# EAGLE schematic CentralBoard less-smd (EAGLE 9.6.2)
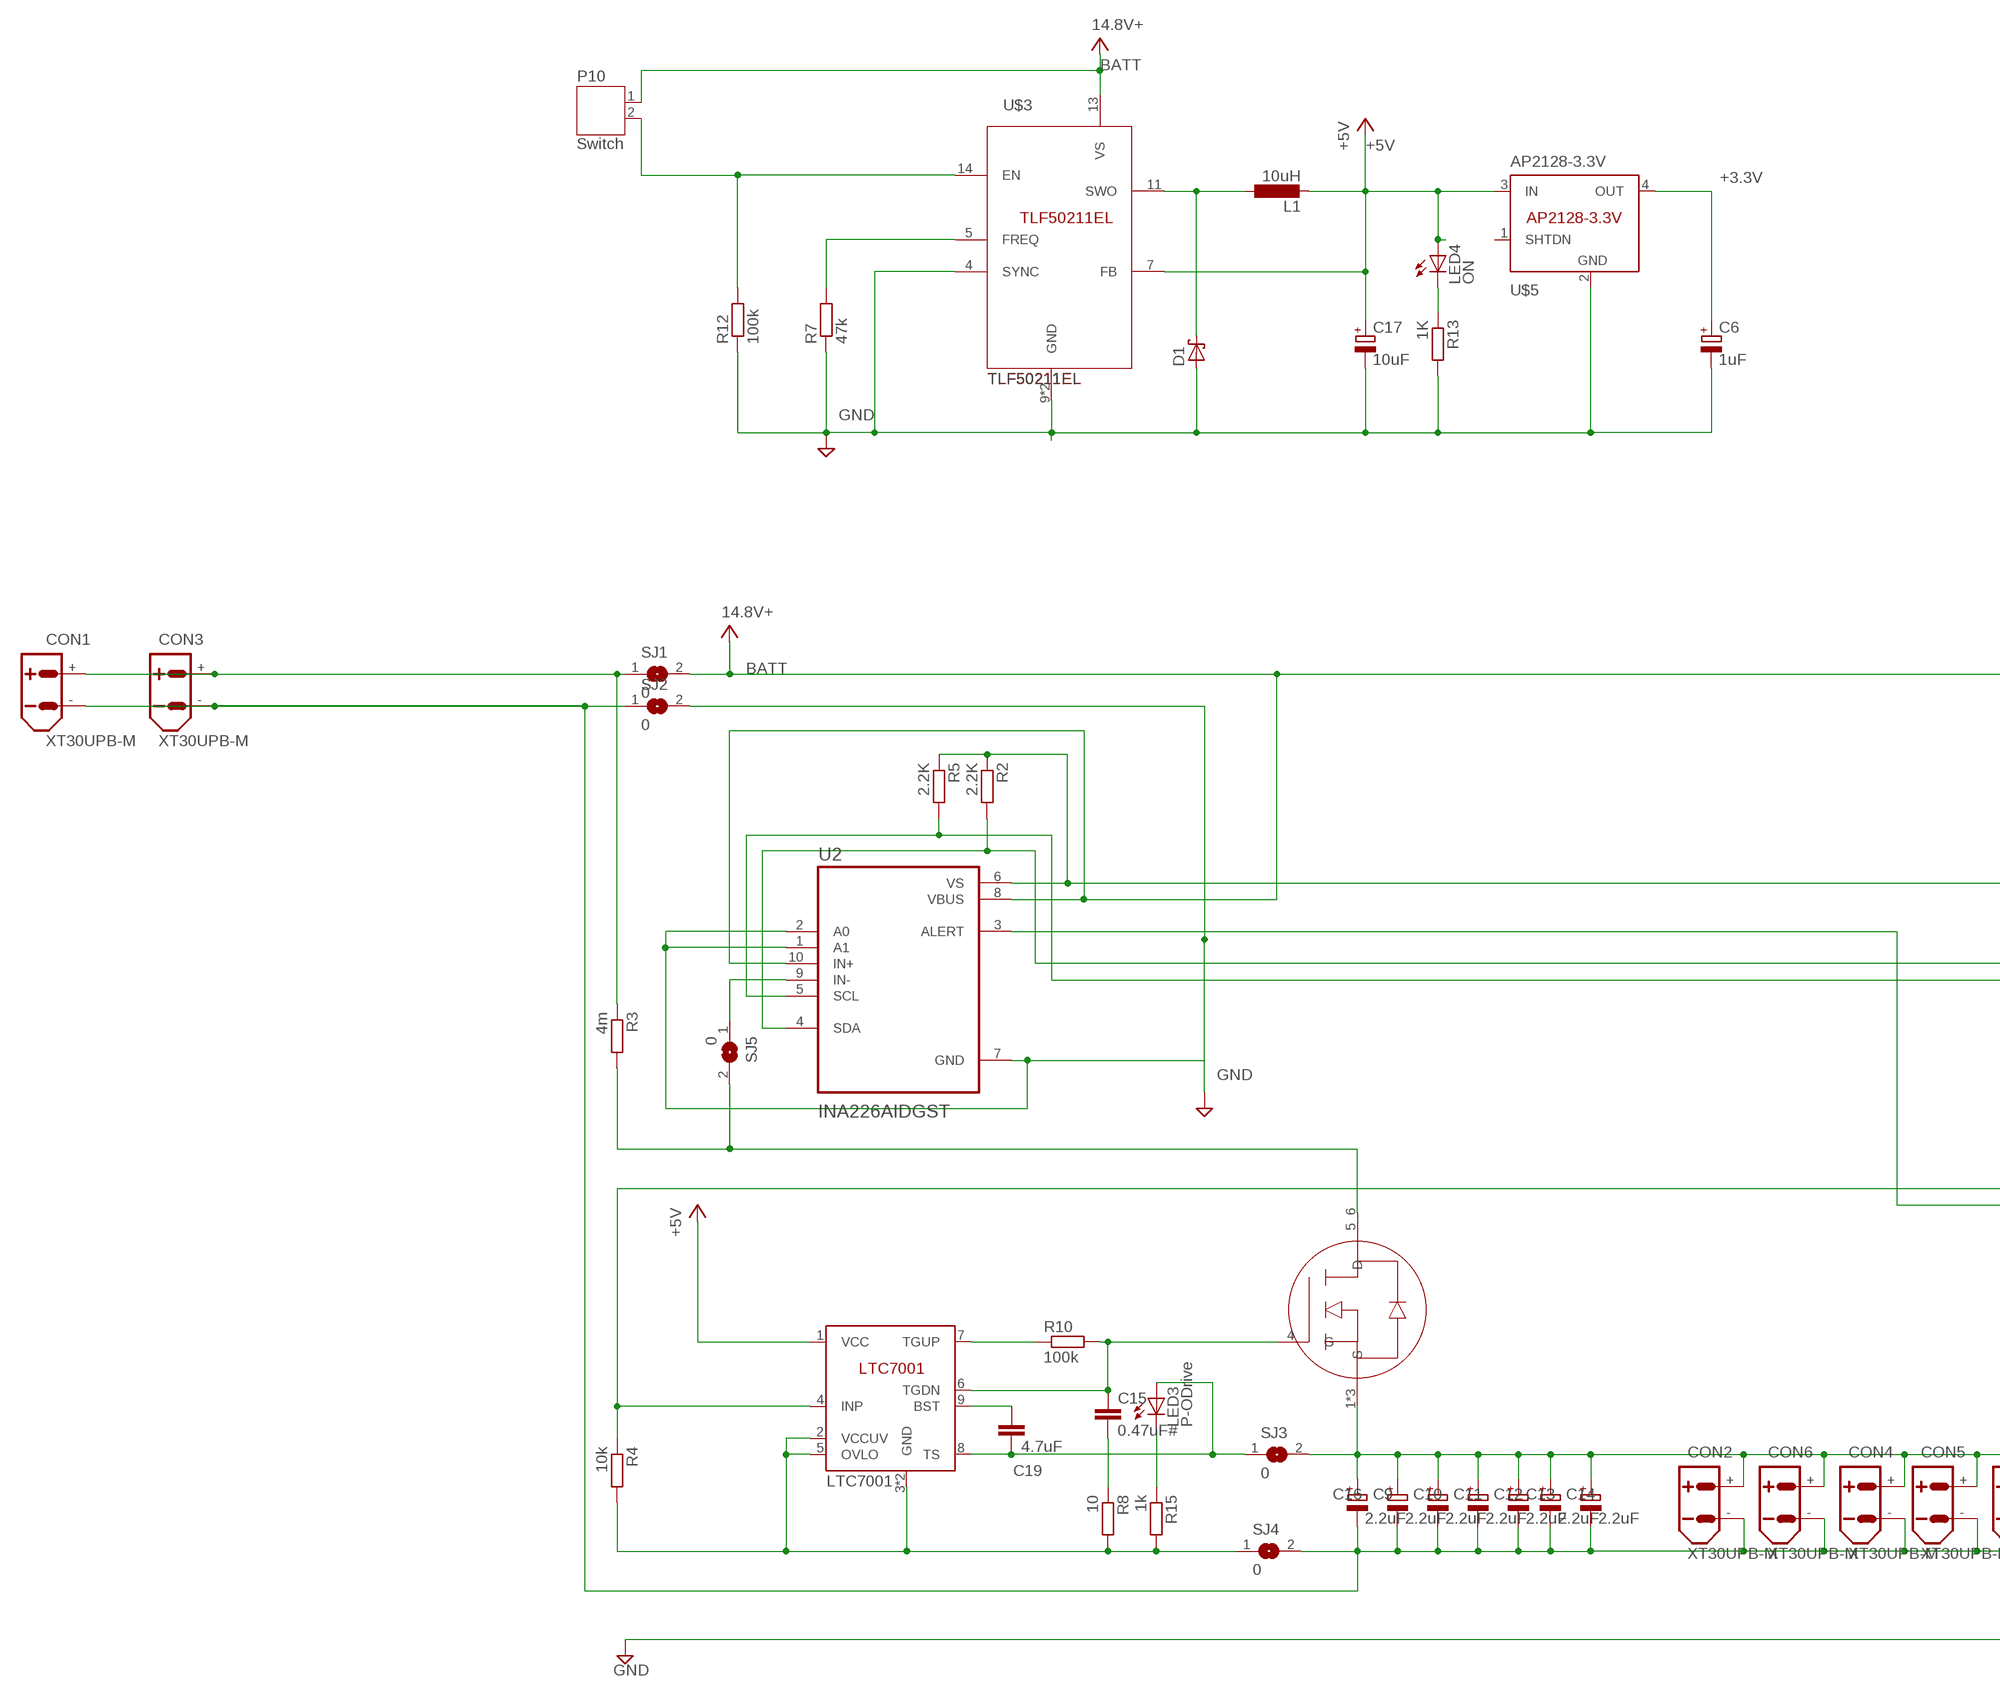
[diagram p0: schematic, sheet 1, part 1 of 2]
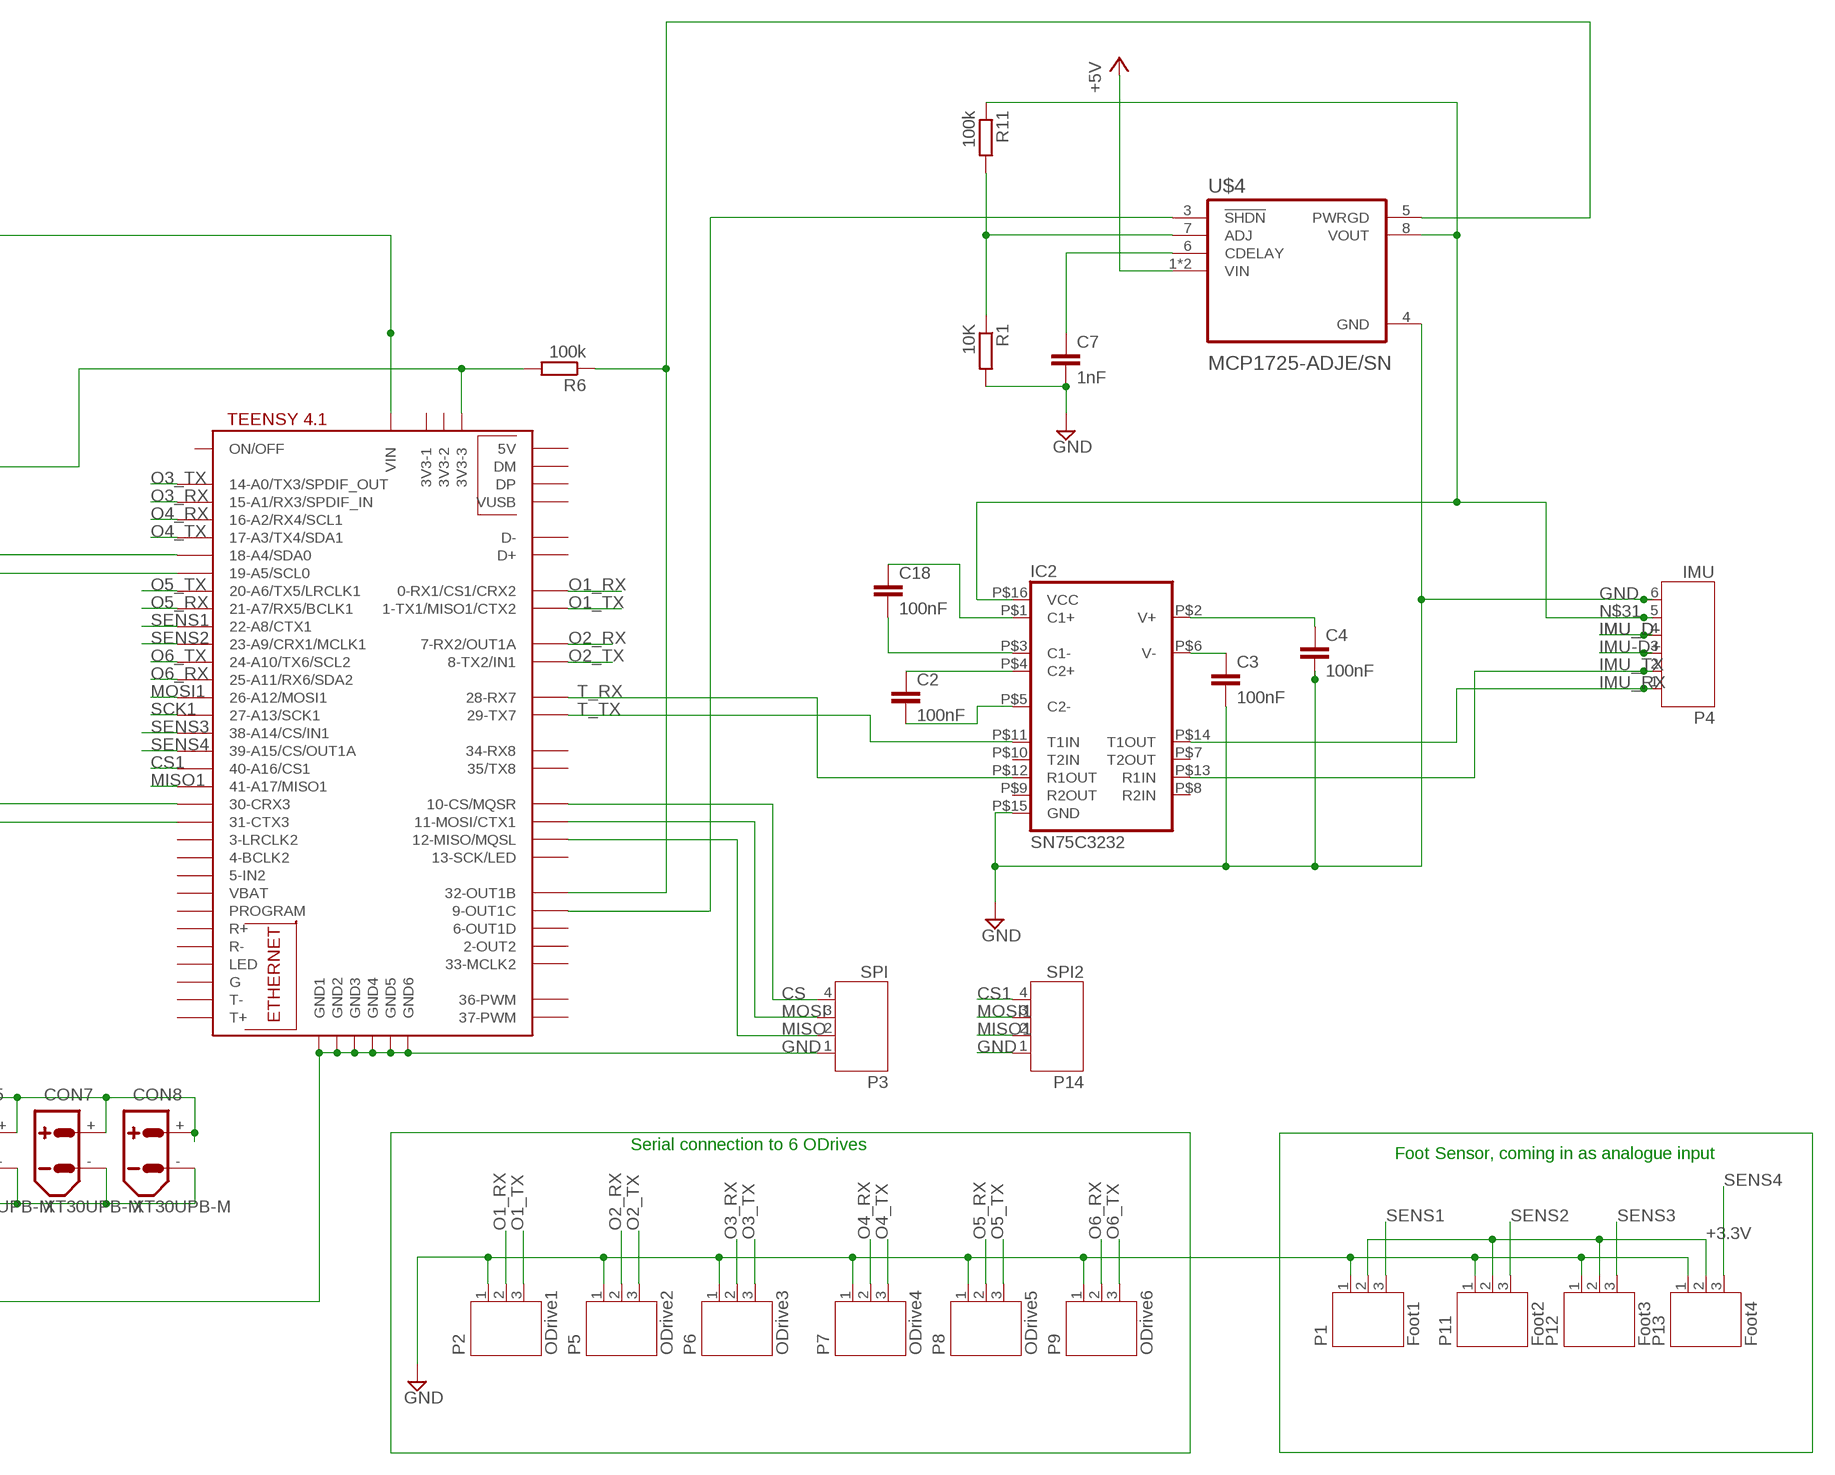
[diagram p1: schematic, sheet 1, part 2 of 2]

## Parts
C2  100nF  C-EU025-025X050  [C025-025X050]
C3  100nF  C-EU025-025X050  [C025-025X050]
C4  100nF  C-EU025-025X050  [C025-025X050]
C6  1uF  CPOL-EUE2-4  [E2-4]
C7  1nF  C-EU025-025X050  [C025-025X050]
C9  2.2uF  CPOL-EUE2-5  [E2-5]
C10  2.2uF  CPOL-EUE2-5  [E2-5]
C11  2.2uF  CPOL-EUE2-5  [E2-5]
C12  2.2uF  CPOL-EUE2-5  [E2-5]
C13  2.2uF  CPOL-EUE2-5  [E2-5]
C14  2.2uF  CPOL-EUE2-5  [E2-5]
C15  0.47uF#  C-EU025-025X050  [C025-025X050]
C16  2.2uF  CPOL-EUE2-5  [E2-5]
C17  10uF  CPOL-EUE2-4  [E2-4]
C18  100nF  C-EU025-025X050  [C025-025X050]
C19  4.7uF  C-EU025-025X050  [C025-025X050]
CON1  XT30UPB-M  [XT30UPB-M]
CON2  XT30UPB-M  [XT30UPB-M]
CON3  XT30UPB-M  [XT30UPB-M]
CON4  XT30UPB-M  [XT30UPB-M]
CON5  XT30UPB-M  [XT30UPB-M]
CON6  XT30UPB-M  [XT30UPB-M]
CON7  XT30UPB-M  [XT30UPB-M]
CON8  XT30UPB-M  [XT30UPB-M]
D1  SCHOTTKY-DIODEDO41  [DO41-10]
IC2  SN75C3232  MAX3232  [SOIC16]
IC3  LTC7001  [MSOP10]
L1  10uH  L-EU0204/5  [0204/5]
LED3  P-ODrive  LED3MM  [LED3MM]
LED4  ON  LED3MM  [LED3MM]
P1  Foot1  JST-PH3  [JST-PH3]
P2  ODrive1  JST-PH3  [JST-PH3]
P3  SPI  JST-PH4  [JST-PH4]
P4  IMU  JST-PH6  [JST-PH6]
P5  ODrive2  JST-PH3  [JST-PH3]
P6  ODrive3  JST-PH3  [JST-PH3]
P7  ODrive4  JST-PH3  [JST-PH3]
P8  ODrive5  JST-PH3  [JST-PH3]
P9  ODrive6  JST-PH3  [JST-PH3]
P10  Switch  JST-PH2  [JST-PH2]
P11  Foot2  JST-PH3  [JST-PH3]
P12  Foot3  JST-PH3  [JST-PH3]
P13  Foot4  JST-PH3  [JST-PH3]
P14  SPI2  JST-PH4  [JST-PH4]
R1  10K  R-EU_0204/7  [0204/7]
R2  2.2K  R-EU_0204/7  [0204/7]
R3  4m  R-EU_R2512  [R2512]
R4  10k  R-EU_0204/7  [0204/7]
R5  2.2K  R-EU_0204/7  [0204/7]
R6  100k  R-EU_0204/7  [0204/7]
R7  47k  R-EU_0204/7  [0204/7]
R8  10  R-EU_0204/7  [0204/7]
R10  100k  R-EU_0204/7  [0204/7]
R11  100k  R-EU_0204/7  [0204/7]
R12  100k  R-EU_0204/7  [0204/7]
R13  1K  R-EU_0204/7  [0204/7]
R15  1k  R-EU_0204/7  [0204/7]
SJ1  0  SJ  [SJ]
SJ2  0  SJ  [SJ]
SJ3  0  SJ  [SJ]
SJ4  0  SJ  [SJ]
SJ5  0  SJ  [SJ]
U2  INA226AIDGST  [SOP50P490X110-10N]
U$1  TEENSY41  [TEENSY41]
U$2  DMTH8003SPS  NVMFS6H824NL-D  [DIO_NTS1045EMFST1G]
U$3  TLF50211EL  [TSSOP-14]
U$4  MCP1725-ADJE/SN  [SOIC127P599X175-8N]
U$5  AP2128-3.3V  [SOT-23-5]

## Nets
+3.3V: C6.+ P1.2 P11.2 P12.2 P13.2 U$5.4(OUT)
+5V: C17.+ IC3.1(VCC) L1.2 LED4.A U$3.7(FB) U$4.1(VIN) U$4.2(VIN) U$5.3(IN)
BATT: P10.1 SJ1.2 U2.8(VBUS) U2.10(IN+) U$3.13(VS) ; supply symbol labelled 14.8V+
BATT+ [Battery]: CON1.+ CON3.+ R3.1 SJ1.1
BATT- [Battery]: C9.- C10.- C11.- C12.- C13.- C14.- C16.- CON1.- CON2.- CON3.- CON4.- CON5.- CON6.- CON7.- CON8.- SJ2.1 SJ4.2
CS: P3.4 U$1.10-CS\MQSR(10-CS/MQSR)
CS1: P14.4 U$1.40-A16/CS1
GND: C3.2 C4.2 C6.- C7.2 C17.- D1.A IC2.P$15(GND) P1.1 P2.1 P3.1 P4.6 P5.1 P6.1 P7.1 P8.1 P9.1 P11.1 P12.1 P13.1 P14.1 R1.2 R7.1 R12.1 R13.2 SJ2.2 U2.1(A1) U2.2(A0) U2.7(GND) U$1.GND1 U$1.GND2 U$1.GND3 U$1.GND4 U$1.GND5 U$1.GND6 U$3.4(SYNC) U$3.9(GND) U$3.10(GND) U$4.4(GND) U$5.2(GND)
IMU-D+: P4.3
IMU_D-: P4.4
IMU_RX: IC2.P$14(T1OUT) P4.1
IMU_TX: IC2.P$13(R1IN) P4.2
IMU_VDD: R6.1 U$1.32-OUT1B U$4.5(PWRGD)
MISO: P3.2 U$1.12-MISO/MQSL
MISO1: P14.2 U$1.41-A17/MISO1
MOSI: P3.3 U$1.11-MOSI/CTX1
MOSI1: P14.3 U$1.26-A12/MOSI1
N$1: U$1.VIN
N$2: LED4.K(C) R13.1
N$3: C7.1 U$4.6(CDELAY)
N$4: IC3.7(TGUP) R10.1
N$5: U2.3(ALERT) U$1.31-CTX3
N$6: C18.1 IC2.P$1(C1+)
N$7: U$1.9-OUT1C U$4.3(!SHDN)
N$8: C18.2 IC2.P$3(C1-)
N$9 [Battery]: R3.2 SJ5.2 U$2.5_6(D)
N$10: IC3.4(INP) R4.1 U$1.30-CRX3
N$11: C2.1 IC2.P$4(C2+)
N$12: C2.2 IC2.P$5(C2-)
N$13: C4.1 IC2.P$2(V+)
N$14: C3.1 IC2.P$6(V-)
N$15: IC3.2(VCCUV) IC3.3(GND) IC3.5(OVLO) IC3.11(GND) R4.2 R8.2 R15.2 SJ4.1
N$16: C15.2 R8.1
N$17: R5.2 U2.5(SCL) U$1.19-A5/SCL0
N$18: SJ5.1 U2.9(IN-)
N$19: C15.1 IC3.6(TGDN) R10.2 U$2.4(G)
N$20: P10.2 R12.2 U$3.14(EN)
N$21 [Battery]: C9.+ C10.+ C11.+ C12.+ C13.+ C14.+ C16.+ CON2.+ CON4.+ CON5.+ CON6.+ CON7.+ CON8.+ SJ3.2 U$2.1(S) U$2.2(S) U$2.3(S)
N$22: R2.2 U2.4(SDA) U$1.18-A4/SDA0
N$23: R2.1 R5.1 R6.2 U2.6(VS) U$1.3V3-3
N$24: C19.1 IC3.9(BST)
N$25: R1.1 R11.2 U$4.7(ADJ)
N$26: C19.2 IC3.8(TS) LED3.A SJ3.1
N$27: R7.2 U$3.5(FREQ)
N$29: D1.C L1.1 U$3.11(SWO)
N$30: LED3.K(C) R15.1
N$31: IC2.P$16(VCC) P4.5 R11.1 U$4.8(VOUT)
O1_RX: P2.2 U$1.0-RX1/CS1/CRX2
O1_TX: P2.3 U$1.1-TX1/MISO1/CTX2
O2_RX: P5.2 U$1.7-RX2/OUT1A
O2_TX: P5.3 U$1.8-TX2/IN1
O3_RX: P6.2 U$1.15-A1/RX3/SPDIF_IN
O3_TX: P6.3 U$1.14-A0/TX3/SPDIF_OUT
O4_RX: P7.2 U$1.16-A2/RX4/SCL1
O4_TX: P7.3 U$1.17-A3/TX4/SDA1
O5_RX: P8.2 U$1.21-A7/RX5/BCLK1
O5_TX: P8.3 U$1.20-A6/TX5/LRCLK1
O6_RX: P9.2 U$1.25-A11/RX6/SDA2
O6_TX: P9.3 U$1.24-A10/TX6/SCL2
SCK1: U$1.27-A13/SCK1
SENS1: P1.3 U$1.22-A8/CTX1
SENS2: P11.3 U$1.23-A9/CRX1/MCLK1
SENS3: P12.3 U$1.38-A14/CS/IN1
SENS4: P13.3 U$1.39-A15/CS/OUT1A
T_RX: IC2.P$12(R1OUT) U$1.28-RX7
T_TX: IC2.P$11(T1IN) U$1.29-TX7
Unconnected: IC2.P$7(T2OUT) IC2.P$8(R2IN) IC2.P$9(R2OUT) IC2.P$10(T2IN) U$1.2-OUT2 U$1.3-LRCLK2 U$1.3V3-1 U$1.3V3-2 U$1.4-BCLK2 U$1.5-IN2 U$1.6-OUT1D U$1.13-SCK/LED U$1.33-MCLK2 U$1.34-RX8 U$1.35-TX8(35/TX8) U$1.36-PWM U$1.37-PWM U$1.+5V(5V) U$1.D+ U$1.D- U$1.DM U$1.DP U$1.G U$1.LED U$1.ON/OFF U$1.PROGRAM U$1.R+ U$1.R- U$1.T+ U$1.T- U$1.VBAT U$1.VUSB U$5.1(SHTDN)

## Notes on the sheet
- Serial connection to 6 ODrives
- Foot Sensor, coming in as analogue input

## Library data of the parts
C2-C4 C7 C15 C18 C19 = rcl:C-EU: CAPACITOR, European symbol; SPICEPREFIX: C
C6 C9-C14 C16 C17 = rcl:CPOL-EU: POLARIZED CAPACITOR, European symbol; SPICEPREFIX: C
CON1-CON8 = amass:XT30: AMASS XT30 connector Store in Japan AMASS XT30 connector <https://szc.jp/ams-xt30>
D1 = adafruit:SCHOTTKY-DIODE: Schottky Diode
IC2 = MAX3232:MAX3232: ±15kV ESD-Protected, Down to 10nA, 3.0V to 5.5V, Up to 1Mbps, True RS-232 Transceivers Check availability <https://pricing.snapeda.com/parts/MAX3232/Maxim%20Integrated/view-part?ref=eda>; AVAILABILITY: In Stock; DESCRIPTION: 2/2 Transceiver Full RS232 16-TQFN (5x5); MF: Maxim Integrated; MP: MAX3232; PACKAGE: SOIC-16 Texas Instruments; PRICE: None; PURCHASE-URL: https://pricing.snapeda.com/search/part/MAX3232/?ref=eda
IC3 = LTC7001:LTC7001: Fast 150V High Side NMOS Static Switch Driver Source: https://www.analog.com/en/products/ltc7001.html; MPN: AD7992BRMZ-0; OC_FARNELL: 1078311; OC_NEWARK: 31M4422
L1 = rcl:L-EU: INDUCTOR, European symbol; SPICEPREFIX: L
LED3 LED4 = adafruit:LED: LED OSRAM: - CHIPLED LG R971, LG N971, LY N971, LG Q971, LY Q971, LO R971, LY R971 LH N974, LH R974 LS Q976, LO Q976, LY Q976 LO Q996 - Hyper CHIPLED LW Q18S LB Q993, LB Q99A, LB R99A - SideLED LS A670, LO A670, LY A670, LG A670, LP A670 LB A673, LV A673, LT A673, LW A673 LH A674 LY A675 LS A676, LA A676, LO A676, LY A676, LW A676 LS A679, LY A679, LG A679 - Hyper Micro SIDELED® LS Y876, LA Y876, LO Y876, LY Y876 LT Y87S - SmartLED LW L88C, LW L88S LB L89C, LB L89S, LG L890 LS L89K, LO L89K, LY L89K LS L896, LA L896, LO L896, LY L896 - TOPLED LS T670, LO T670, LY T670, LG T670, LP T670 LSG T670, LSP T670, LSY T670, LOP T670, LYG T670 LG T671, LOG T671, LSG T671 LB T673, LV T673, LT T673, LW T673 LH T674 LS T676, LA T676, LO T676, LY T676, LB T676, LH T676, LSB T676, LW T676 LB T67C, LV T67C, LT T67C, LS T67K, LO T67K, LY T67K, LW E67C LS E67B, LA E67B, LO E67B, LY E67B, LB E67C, LV E67C, LT E67C LW T67C LS T679, LY T679, LG T679 LS T770, LO T770, LY T770, LG T770, LP T770 LB T773, LV T773, LT T773, LW T773 LH T774 LS E675, LA E675, LY E675, LS T675 LS T776, LA T776, LO T776, LY T776, LB T776 LHGB T686 LT T68C, LB T68C - Hyper Mini TOPLED® LB M676 - Mini TOPLED Santana® LG M470 LS M47K, LO M47K, LY M47K Source: http://www.osram.convergy.de/
P1 P2 P5-P9 P11-P13 = jst-ph:JST-PH3
P3 P14 = jst-ph:JST-PH4
P4 = jst-ph:JST-PH6
P10 = jst-ph:JST-PH2
R1 R2 R4-R8 R10-R13 R15 = rcl:R-EU_: RESISTOR, European symbol; SPICEPREFIX: R
R3 = rcl:R-EU_: RESISTOR, European symbol; DIGIKEY: 541-WSK25124L000FEACT-ND; LINK: https://octopart.com/wsk25124l000fea-vishay-41934978?r=sp; MOUSER: 71-WSK25124L000FEA; SPICEPREFIX: R
SJ1-SJ5 = jumper:SJ: SMD solder JUMPER
U2 = INA226AIDGST:INA226AIDGST: Check availability <https://pricing.snapeda.com/parts/INA226AIDGST/Texas%20Instruments/view-part?ref=eda>; AVAILABILITY: In Stock; DESCRIPTION: 36V, 16-bit, ultra-precise i2c output current/voltage/power monitor w/alert; MF: Texas Instruments; MP: INA226AIDGST; PACKAGE: VSSOP-10 Texas Instruments; PRICE: None; PURCHASE-URL: https://pricing.snapeda.com/search/part/INA226AIDGST/?ref=eda
U$1 = teensy:TEENSY41
U$2 = DIO_NTS1045EMFST1G:NVMFS6H824NL-D
U$3 = TLF50211EL:TLF50211EL: TLF50211EL 2.2 MHz Step-Down Regulator 500 mA, 5 V, low quiescent current https://www.infineon.com/dgdl/Infineon-TLF50211EL-DS-v01_10-EN.pdf?fileId=5546d46258fc0bc1015969d2af9641e9
U$4 = MCP1725-ADJE_SN:MCP1725-ADJE/SN: Check availability <https://pricing.snapeda.com/parts/MCP1725-ADJE/SN/Microchip/view-part?ref=eda>; AVAILABILITY: In Stock; DESCRIPTION: Linear Voltage Regulator IC Positive Adjustable 1 Output 500mA 8-SOIC; MF: Microchip; MP: MCP1725-ADJE/SN; PACKAGE: SOIC-8 Microchip; PRICE: None; PURCHASE-URL: https://pricing.snapeda.com/search/part/MCP1725-ADJE/SN/?ref=eda
U$5 = AP2128:AP2128-3.3V: AP2128-3.3V 300mA HIGH SPEED, EXTREMELY LOW NOISE CMOS LDO REGULATOR https://www.diodes.com/assets/Datasheets/AP2128.pdf

## Net classes
0 default: width 0.254 mm
1 Battery: width 1.397 mm